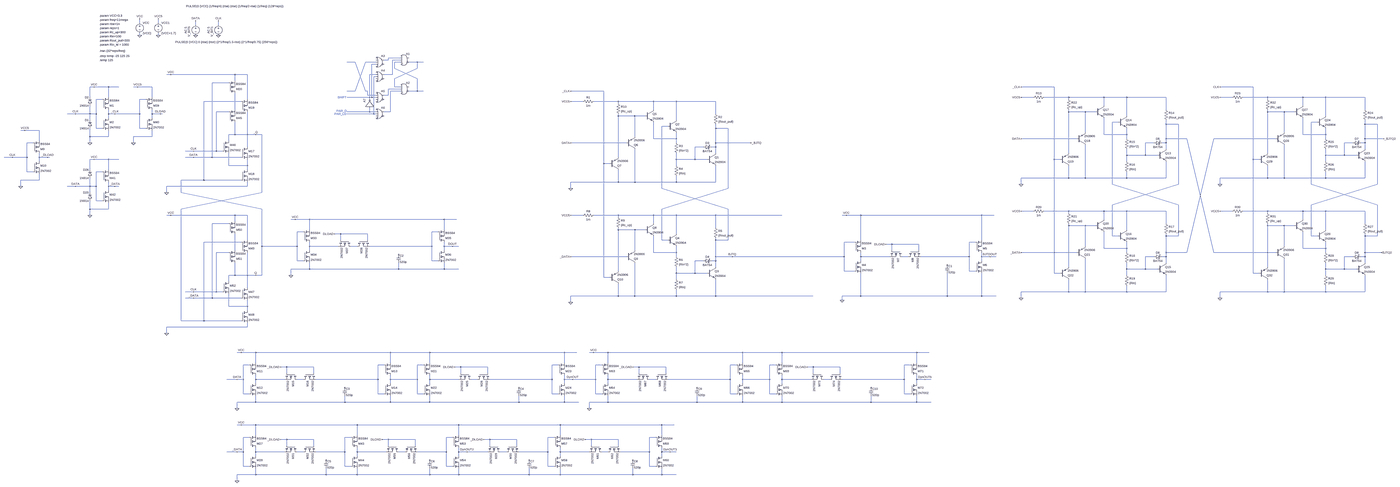
[diagram p0: schematic d_flop_cmos.asc, whole sheet]
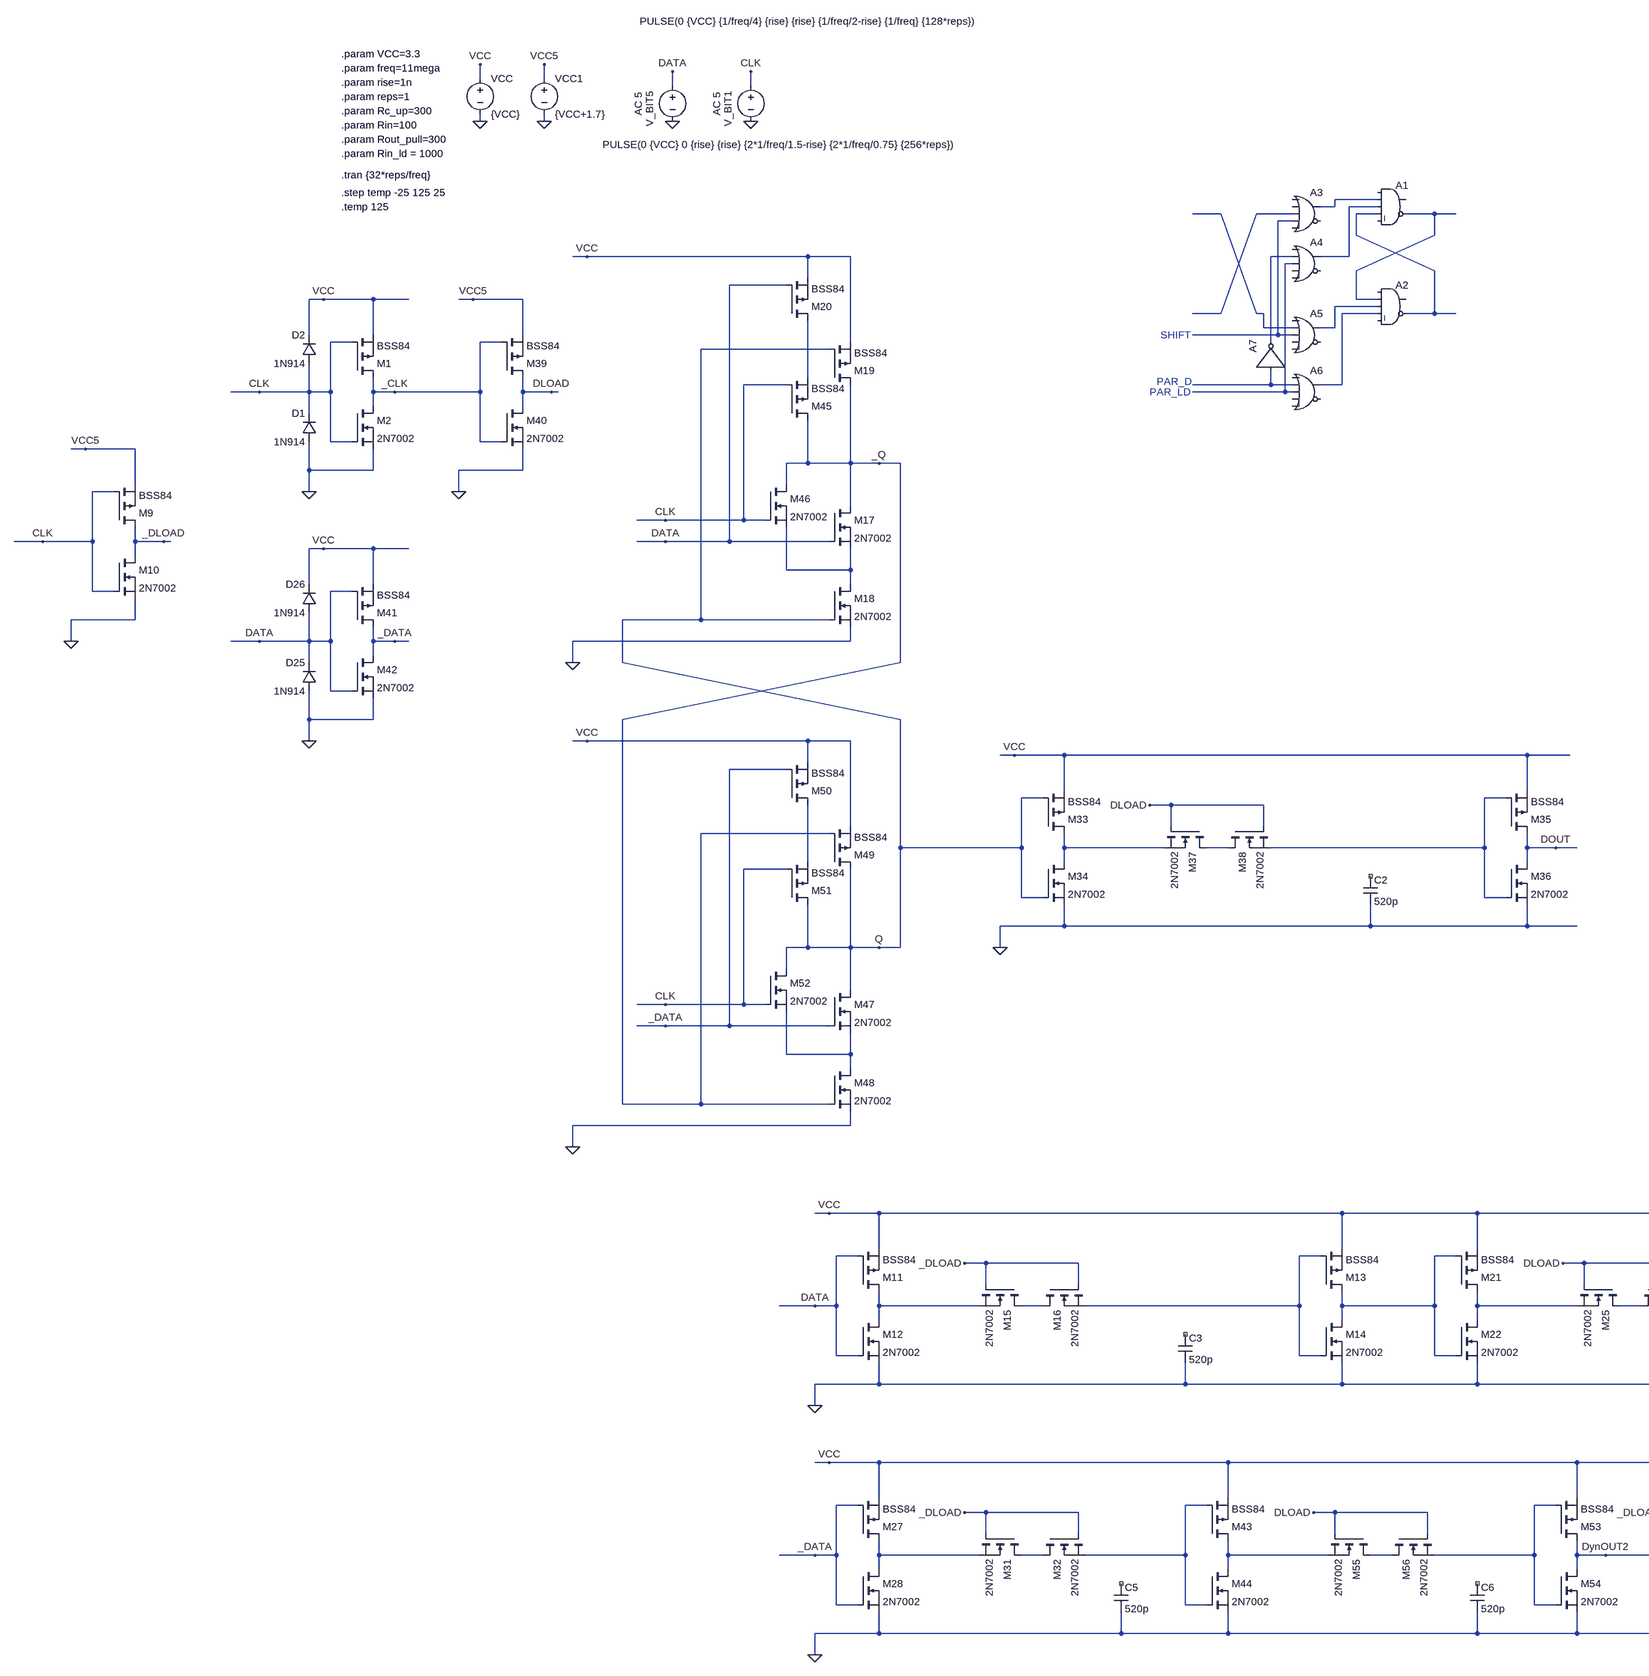
[diagram p1: schematic d_flop_cmos.asc, part, row 1 of 1, column 1 of 3]
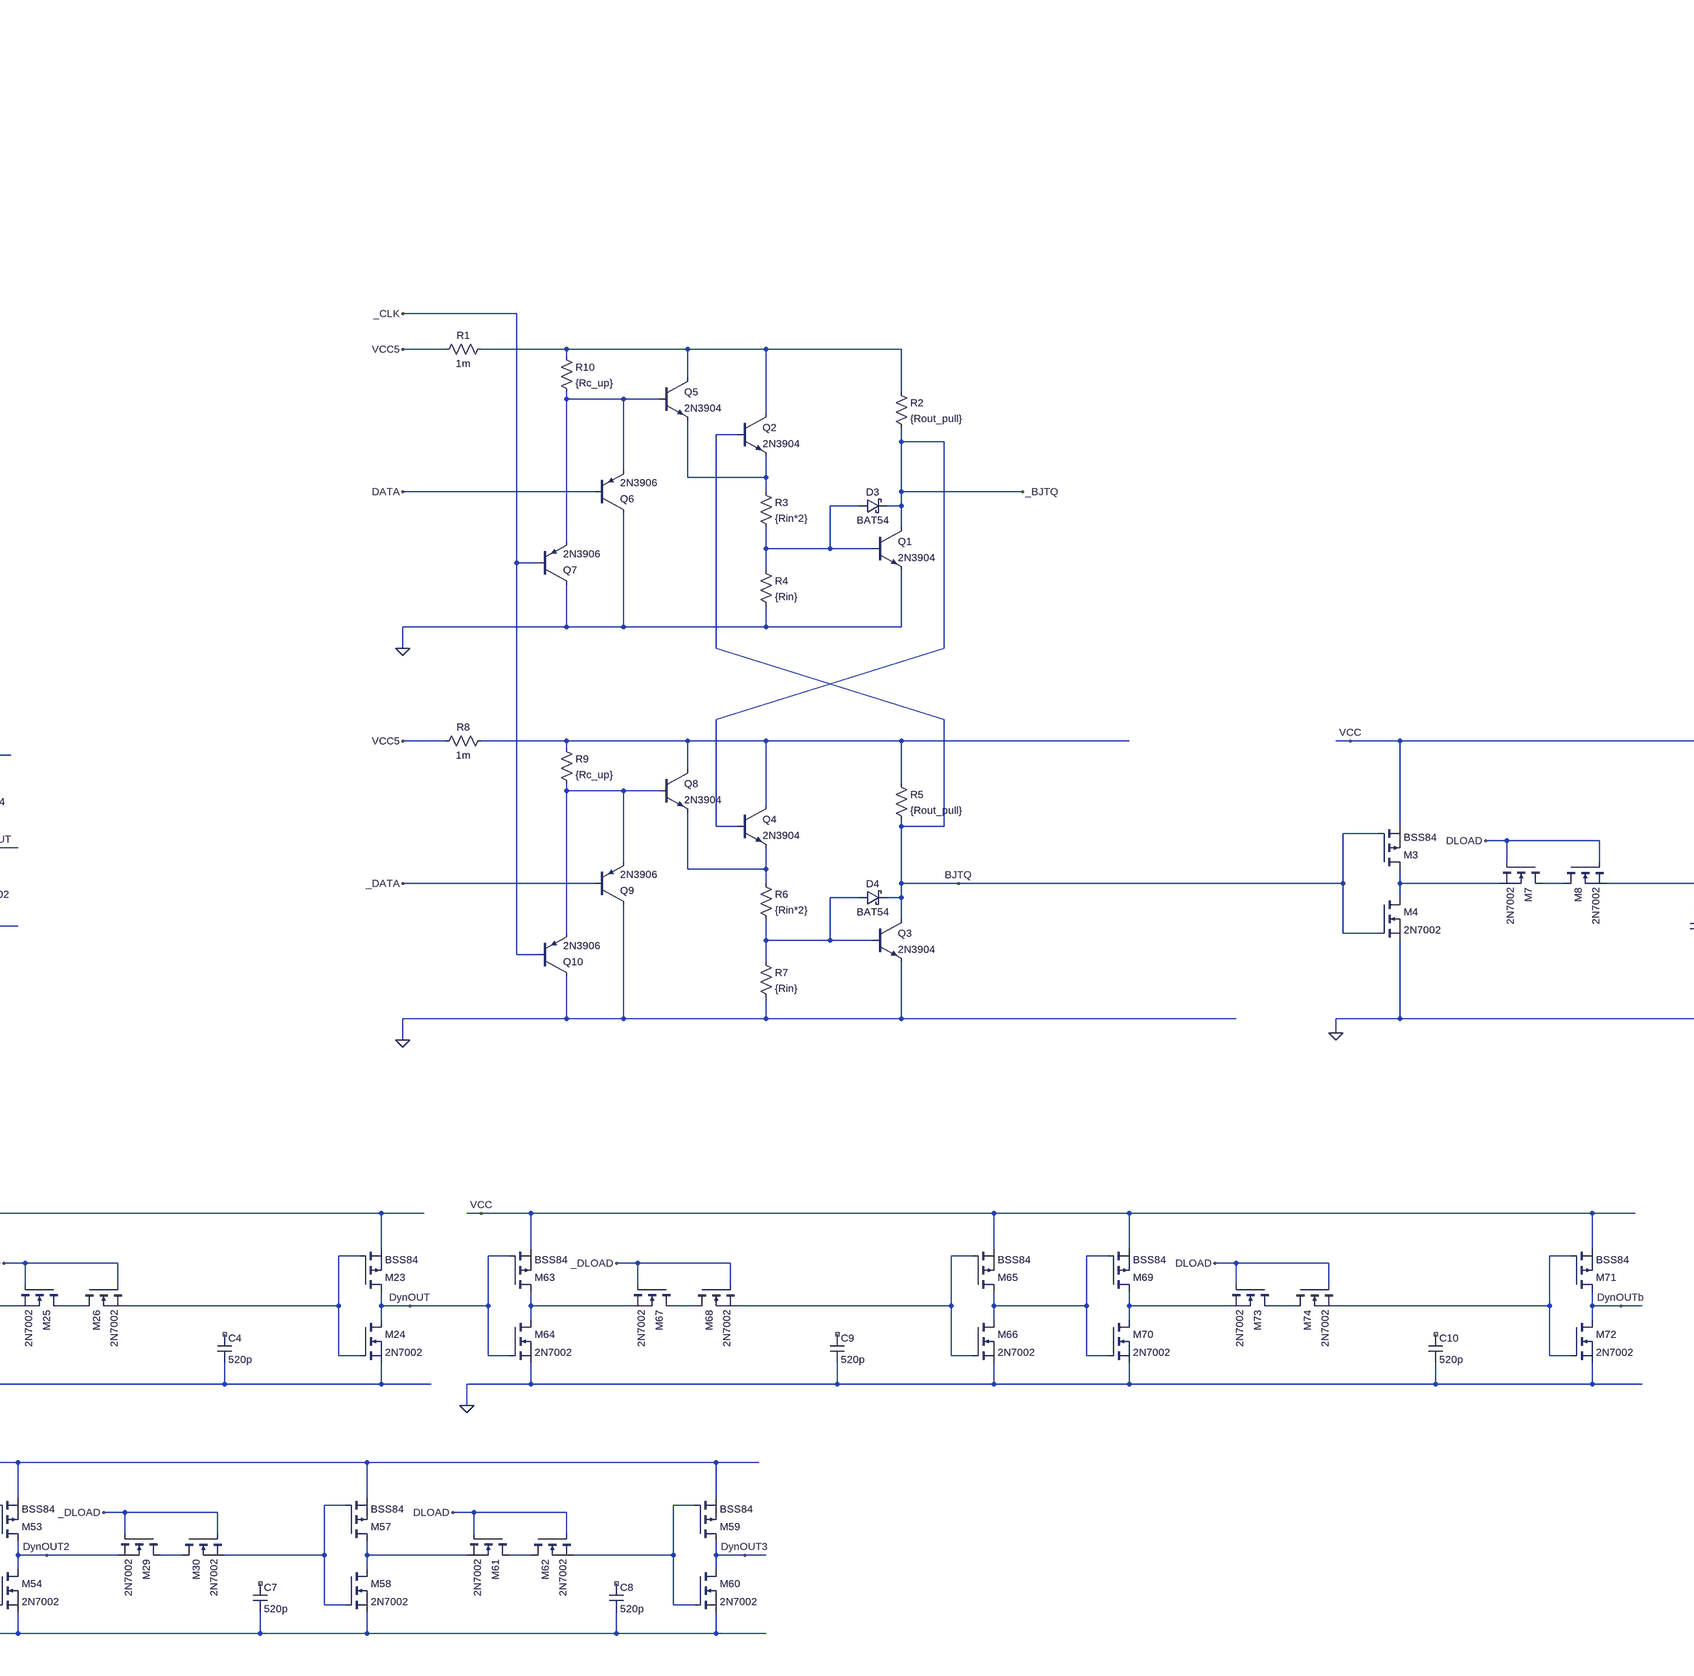
[diagram p2: schematic d_flop_cmos.asc, part, row 1 of 1, column 2 of 3]
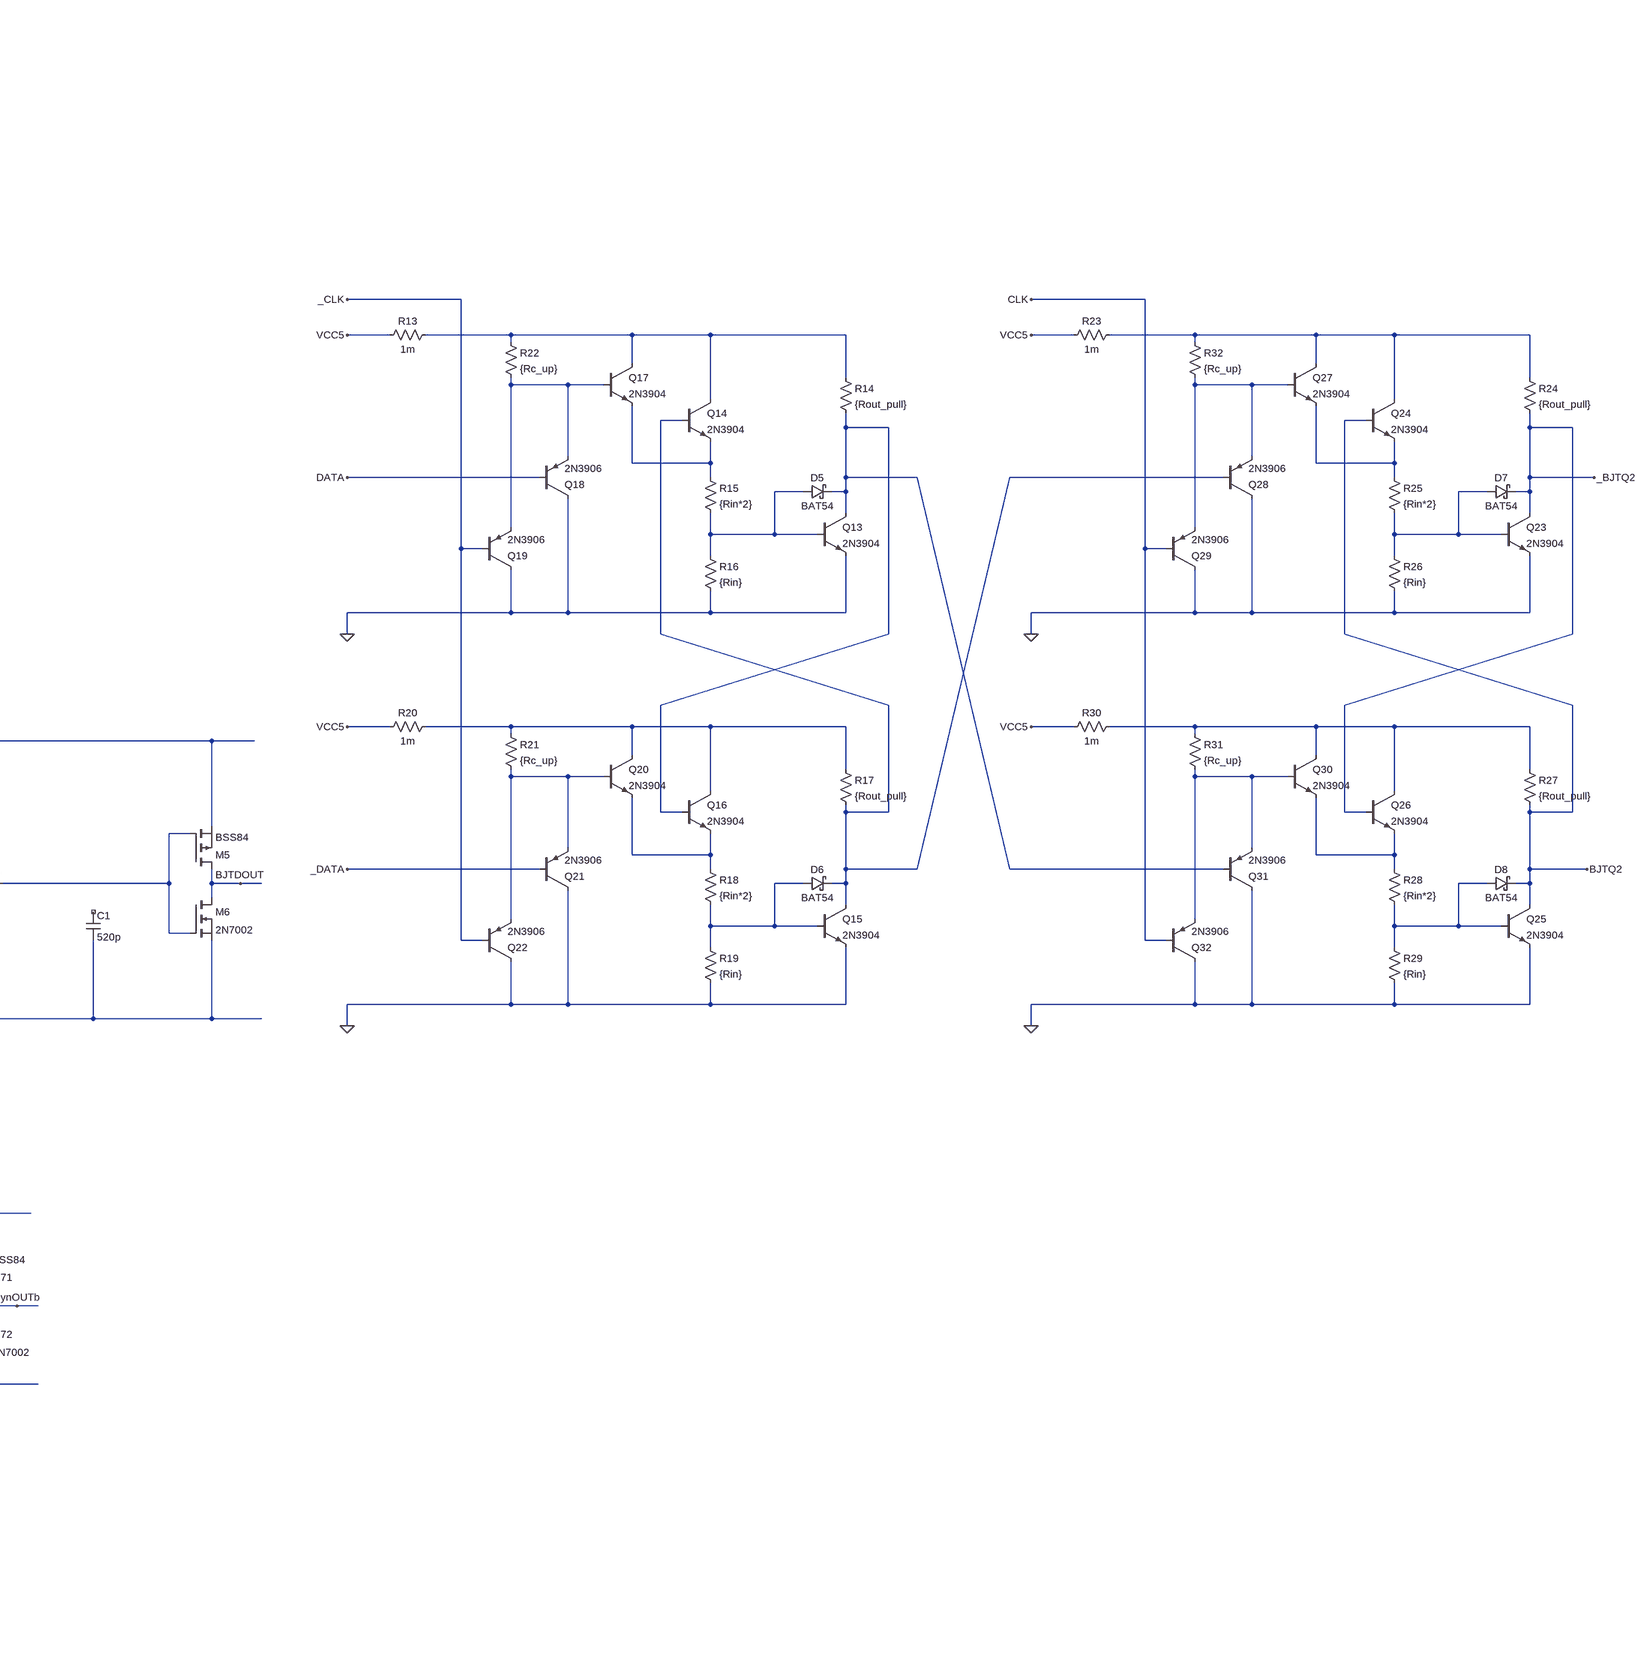
[diagram p3: schematic d_flop_cmos.asc, part, row 1 of 1, column 3 of 3]
d_flop_cmos.asc, the LTspice schematic file:
Version 4
SHEET 1 37460 9492
WIRE -2432 5424 -2432 5392
WIRE -2288 5424 -2288 5392
WIRE -2000 5440 -2000 5408
WIRE -1824 5440 -1824 5408
WIRE -2432 5520 -2432 5504
WIRE -2288 5520 -2288 5504
WIRE -416 5696 -512 5696
WIRE -512 5712 -512 5696
WIRE -512 5712 -544 5712
WIRE -416 5712 -480 5712
WIRE -768 5728 -832 5728
WIRE -608 5728 -688 5728
WIRE -416 5728 -464 5728
WIRE -288 5728 -352 5728
WIRE -240 5728 -288 5728
WIRE -608 5744 -640 5744
WIRE -464 5776 -464 5728
WIRE -288 5776 -288 5728
WIRE -2192 5824 -2224 5824
WIRE -1696 5824 -2192 5824
WIRE -1600 5824 -1696 5824
WIRE -608 5824 -656 5824
WIRE -480 5824 -480 5712
WIRE -480 5824 -544 5824
WIRE -608 5840 -624 5840
WIRE -464 5856 -288 5776
WIRE -288 5856 -464 5776
WIRE -1696 5872 -1696 5824
WIRE -1744 5888 -1872 5888
WIRE -2784 5920 -2816 5920
WIRE -2672 5920 -2784 5920
WIRE -2592 5920 -2672 5920
WIRE -2448 5920 -2480 5920
WIRE -2336 5920 -2448 5920
WIRE -464 5920 -464 5856
WIRE -416 5920 -464 5920
WIRE 5184 5920 4928 5920
WIRE 6720 5920 6464 5920
WIRE -416 5936 -512 5936
WIRE -768 5952 -688 5728
WIRE -768 5952 -832 5952
WIRE -688 5952 -768 5728
WIRE -672 5952 -688 5952
WIRE -416 5952 -496 5952
WIRE -288 5952 -288 5856
WIRE -288 5952 -352 5952
WIRE -240 5952 -288 5952
WIRE 1152 5952 896 5952
WIRE -672 5984 -672 5952
WIRE -608 5984 -672 5984
WIRE -512 5984 -512 5936
WIRE -512 5984 -544 5984
WIRE -2816 6000 -2816 5920
WIRE -2672 6000 -2672 5920
WIRE -2336 6000 -2336 5920
WIRE -640 6000 -640 5744
WIRE -640 6000 -832 6000
WIRE -608 6000 -640 6000
WIRE 5024 6000 4928 6000
WIRE 5296 6000 5104 6000
WIRE 5568 6000 5296 6000
WIRE 5744 6000 5568 6000
WIRE 6048 6000 5744 6000
WIRE 6560 6000 6464 6000
WIRE 6832 6000 6640 6000
WIRE 7104 6000 6832 6000
WIRE 7280 6000 7104 6000
WIRE 7584 6000 7280 6000
WIRE -2720 6016 -2768 6016
WIRE -2384 6016 -2432 6016
WIRE -1600 6016 -1600 5824
WIRE -656 6016 -656 5824
WIRE 5296 6016 5296 6000
WIRE 6832 6016 6832 6000
WIRE -1648 6032 -1936 6032
WIRE 992 6032 896 6032
WIRE 1264 6032 1072 6032
WIRE 1536 6032 1264 6032
WIRE 1712 6032 1536 6032
WIRE 2016 6032 1712 6032
WIRE 1264 6048 1264 6032
WIRE 5568 6064 5568 6000
WIRE 7104 6064 7104 6000
WIRE -1696 6096 -1696 5968
WIRE 1536 6096 1536 6032
WIRE 6048 6096 6048 6000
WIRE 7584 6096 7584 6000
WIRE -1744 6112 -1840 6112
WIRE -656 6112 -656 6080
WIRE -656 6112 -832 6112
WIRE -608 6112 -656 6112
WIRE -496 6112 -496 5952
WIRE -496 6112 -544 6112
WIRE 5296 6112 5296 6096
WIRE 5424 6112 5296 6112
WIRE 5504 6112 5424 6112
WIRE 6832 6112 6832 6096
WIRE 6960 6112 6832 6112
WIRE 7040 6112 6960 6112
WIRE -2928 6128 -2992 6128
WIRE -2816 6128 -2816 6064
WIRE -2816 6128 -2928 6128
WIRE -2768 6128 -2768 6016
WIRE -2768 6128 -2816 6128
WIRE -2672 6128 -2672 6096
WIRE -2624 6128 -2672 6128
WIRE -2432 6128 -2432 6016
WIRE -2432 6128 -2624 6128
WIRE -2336 6128 -2336 6096
WIRE -2272 6128 -2336 6128
WIRE -2256 6128 -2272 6128
WIRE -624 6128 -624 5840
WIRE -624 6128 -832 6128
WIRE -608 6128 -624 6128
WIRE 2016 6128 2016 6032
WIRE 1264 6144 1264 6128
WIRE 1392 6144 1264 6144
WIRE 1472 6144 1392 6144
WIRE 5744 6144 5744 6000
WIRE 7280 6144 7280 6000
WIRE -2672 6160 -2672 6128
WIRE -2336 6160 -2336 6128
WIRE -2816 6176 -2816 6128
WIRE 1712 6176 1712 6032
WIRE 5680 6192 5632 6192
WIRE 7216 6192 7168 6192
WIRE 6048 6208 6048 6176
WIRE 6144 6208 6048 6208
WIRE 7584 6208 7584 6176
WIRE 7680 6208 7584 6208
WIRE 1648 6224 1600 6224
WIRE -2768 6240 -2768 6128
WIRE -2720 6240 -2768 6240
WIRE -2432 6240 -2432 6128
WIRE -2384 6240 -2432 6240
WIRE 2016 6240 2016 6208
WIRE 2112 6240 2016 6240
WIRE -3344 6256 -3376 6256
WIRE -3232 6256 -3344 6256
WIRE 5424 6272 5424 6112
WIRE 6960 6272 6960 6112
WIRE -1696 6288 -1696 6192
WIRE -1696 6288 -1744 6288
WIRE -1600 6288 -1600 6112
WIRE -1600 6288 -1696 6288
WIRE -1536 6288 -1600 6288
WIRE -1488 6288 -1536 6288
WIRE 5568 6288 5568 6160
WIRE 5744 6288 5744 6240
WIRE 5744 6288 5568 6288
WIRE 7104 6288 7104 6160
WIRE 7280 6288 7280 6240
WIRE 7280 6288 7104 6288
WIRE -2816 6304 -2816 6240
WIRE -2672 6304 -2672 6256
WIRE -2672 6304 -2816 6304
WIRE -2336 6304 -2336 6256
WIRE -2336 6304 -2480 6304
WIRE 1392 6304 1392 6144
WIRE 1536 6320 1536 6192
WIRE 1712 6320 1712 6272
WIRE 1712 6320 1536 6320
WIRE 5360 6320 4928 6320
WIRE 5744 6320 5744 6288
WIRE 6048 6320 6048 6208
WIRE 6208 6320 6048 6320
WIRE 6896 6320 6416 6320
WIRE 7280 6320 7280 6288
WIRE 7584 6320 7584 6208
WIRE 7728 6320 7584 6320
WIRE -3232 6336 -3232 6256
WIRE -1744 6336 -1744 6288
WIRE -3280 6352 -3328 6352
WIRE -2816 6352 -2816 6304
WIRE -2480 6352 -2480 6304
WIRE 1328 6352 896 6352
WIRE 1712 6352 1712 6320
WIRE 2016 6352 2016 6240
WIRE 2288 6352 2016 6352
WIRE 5952 6352 5888 6352
WIRE 6048 6352 6048 6320
WIRE 6048 6352 6016 6352
WIRE 7488 6352 7424 6352
WIRE 7584 6352 7584 6320
WIRE 7584 6352 7552 6352
WIRE -1600 6384 -1600 6288
WIRE 1920 6384 1856 6384
WIRE 2016 6384 2016 6352
WIRE 2016 6384 1984 6384
WIRE 6048 6400 6048 6352
WIRE 7584 6400 7584 6352
WIRE -2016 6416 -2080 6416
WIRE -1840 6416 -1840 6112
WIRE -1840 6416 -2016 6416
WIRE -1792 6416 -1840 6416
WIRE 2016 6432 2016 6384
WIRE 5296 6432 5296 6112
WIRE 6832 6432 6832 6112
WIRE 5744 6448 5744 6400
WIRE 5888 6448 5888 6352
WIRE 5888 6448 5744 6448
WIRE 5984 6448 5888 6448
WIRE 7280 6448 7280 6400
WIRE 7424 6448 7424 6352
WIRE 7424 6448 7280 6448
WIRE 7520 6448 7424 6448
WIRE -3440 6464 -3504 6464
WIRE -3328 6464 -3328 6352
WIRE -3328 6464 -3440 6464
WIRE -3232 6464 -3232 6432
WIRE -3168 6464 -3232 6464
WIRE -3152 6464 -3168 6464
WIRE -2016 6464 -2080 6464
WIRE -1872 6464 -1872 5888
WIRE -1872 6464 -2016 6464
WIRE -1648 6464 -1872 6464
WIRE 1264 6464 1264 6144
WIRE -2784 6480 -2816 6480
WIRE -2672 6480 -2784 6480
WIRE -2592 6480 -2672 6480
WIRE 1712 6480 1712 6432
WIRE 1856 6480 1856 6384
WIRE 1856 6480 1712 6480
WIRE 1952 6480 1856 6480
WIRE 5184 6480 5184 5920
WIRE 5232 6480 5184 6480
WIRE 6720 6480 6720 5920
WIRE 6768 6480 6720 6480
WIRE -3232 6496 -3232 6464
WIRE 5744 6496 5744 6448
WIRE 7280 6496 7280 6448
WIRE 1152 6512 1152 5952
WIRE 1200 6512 1152 6512
WIRE -1744 6528 -1744 6432
WIRE -1600 6528 -1600 6480
WIRE -1600 6528 -1744 6528
WIRE 1712 6528 1712 6480
WIRE -2816 6560 -2816 6480
WIRE -2672 6560 -2672 6480
WIRE -1600 6560 -1600 6528
WIRE -3328 6576 -3328 6464
WIRE -3280 6576 -3328 6576
WIRE -2720 6576 -2768 6576
WIRE 5296 6624 5296 6528
WIRE 5296 6624 4928 6624
WIRE 5424 6624 5424 6368
WIRE 5424 6624 5296 6624
WIRE 5744 6624 5744 6576
WIRE 5744 6624 5424 6624
WIRE 6048 6624 6048 6496
WIRE 6048 6624 5744 6624
WIRE 6832 6624 6832 6528
WIRE 6832 6624 6464 6624
WIRE 6960 6624 6960 6368
WIRE 6960 6624 6832 6624
WIRE 7280 6624 7280 6576
WIRE 7280 6624 6960 6624
WIRE 7584 6624 7584 6496
WIRE 7584 6624 7280 6624
WIRE -3232 6640 -3232 6592
WIRE -3232 6640 -3376 6640
WIRE -1936 6640 -1936 6032
WIRE -1936 6640 -2112 6640
WIRE -1648 6640 -1936 6640
WIRE 1264 6656 1264 6560
WIRE 1264 6656 896 6656
WIRE 1392 6656 1392 6400
WIRE 1392 6656 1264 6656
WIRE 1712 6656 1712 6608
WIRE 1712 6656 1392 6656
WIRE 2016 6656 2016 6528
WIRE 2016 6656 1712 6656
WIRE 4928 6672 4928 6624
WIRE 5632 6672 5632 6192
WIRE 6144 6672 6144 6208
WIRE 6464 6672 6464 6624
WIRE 7168 6672 7168 6192
WIRE 7680 6672 7680 6208
WIRE -3376 6688 -3376 6640
WIRE -2928 6688 -2992 6688
WIRE -2816 6688 -2816 6624
WIRE -2816 6688 -2928 6688
WIRE -2768 6688 -2768 6576
WIRE -2768 6688 -2816 6688
WIRE -2672 6688 -2672 6656
WIRE -2624 6688 -2672 6688
WIRE -2592 6688 -2624 6688
WIRE -1600 6688 -1600 6656
WIRE -1600 6688 -2224 6688
WIRE 896 6704 896 6656
WIRE 1600 6704 1600 6224
WIRE 2112 6704 2112 6240
WIRE -2672 6720 -2672 6688
WIRE -2816 6736 -2816 6688
WIRE -2224 6736 -2224 6688
WIRE -2112 6736 -2112 6640
WIRE -1488 6736 -1488 6288
WIRE -2768 6800 -2768 6688
WIRE -2720 6800 -2768 6800
WIRE 5632 6832 6144 6672
WIRE 6144 6832 5632 6672
WIRE 7168 6832 7680 6672
WIRE 7680 6832 7168 6672
WIRE -2816 6864 -2816 6800
WIRE -2672 6864 -2672 6816
WIRE -2672 6864 -2816 6864
WIRE -2112 6864 -1488 6736
WIRE -1488 6864 -2112 6736
WIRE 1600 6864 2112 6704
WIRE 2112 6864 1600 6704
WIRE 5024 6880 4928 6880
WIRE 5296 6880 5104 6880
WIRE 5568 6880 5296 6880
WIRE 5744 6880 5568 6880
WIRE 6048 6880 5744 6880
WIRE 6560 6880 6464 6880
WIRE 6832 6880 6640 6880
WIRE 7104 6880 6832 6880
WIRE 7280 6880 7104 6880
WIRE 7584 6880 7280 6880
WIRE 5296 6896 5296 6880
WIRE 6832 6896 6832 6880
WIRE -2816 6912 -2816 6864
WIRE -2192 6912 -2224 6912
WIRE -1696 6912 -2192 6912
WIRE -1600 6912 -1696 6912
WIRE 992 6912 896 6912
WIRE 1264 6912 1072 6912
WIRE 1536 6912 1264 6912
WIRE 1712 6912 1536 6912
WIRE 2016 6912 1712 6912
WIRE 2528 6912 2016 6912
WIRE 3024 6912 2992 6912
WIRE 3136 6912 3024 6912
WIRE 4176 6912 3136 6912
WIRE 4272 6912 4176 6912
WIRE 1264 6928 1264 6912
WIRE -1232 6944 -1264 6944
WIRE -1120 6944 -1232 6944
WIRE -80 6944 -1120 6944
WIRE 16 6944 -80 6944
WIRE 5568 6944 5568 6880
WIRE 7104 6944 7104 6880
WIRE -1696 6960 -1696 6912
WIRE -1744 6976 -1872 6976
WIRE 1536 6976 1536 6912
WIRE 6048 6976 6048 6880
WIRE 7584 6976 7584 6880
WIRE 5296 6992 5296 6976
WIRE 5424 6992 5296 6992
WIRE 5504 6992 5424 6992
WIRE 6832 6992 6832 6976
WIRE 6960 6992 6832 6992
WIRE 7040 6992 6960 6992
WIRE 2016 7008 2016 6912
WIRE -1120 7024 -1120 6944
WIRE -80 7024 -80 6944
WIRE 1264 7024 1264 7008
WIRE 1392 7024 1264 7024
WIRE 1472 7024 1392 7024
WIRE 5744 7024 5744 6880
WIRE 7280 7024 7280 6880
WIRE -1168 7040 -1216 7040
WIRE -128 7040 -176 7040
WIRE -880 7056 -928 7056
WIRE -672 7056 -880 7056
WIRE 1712 7056 1712 6912
WIRE 5632 7072 5632 6832
WIRE 5680 7072 5632 7072
WIRE 6048 7072 6048 7056
WIRE 6144 7072 6144 6832
WIRE 6144 7072 6048 7072
WIRE 7168 7072 7168 6832
WIRE 7216 7072 7168 7072
WIRE 7584 7072 7584 7056
WIRE 7680 7072 7680 6832
WIRE 7680 7072 7584 7072
WIRE -1600 7104 -1600 6912
WIRE -880 7104 -880 7056
WIRE -672 7104 -672 7056
WIRE 1600 7104 1600 6864
WIRE 1648 7104 1600 7104
WIRE 2016 7104 2016 7088
WIRE 2112 7104 2112 6864
WIRE 2112 7104 2016 7104
WIRE 3136 7104 3136 6912
WIRE 4176 7104 4176 6912
WIRE -1648 7120 -1936 7120
WIRE 3088 7120 3008 7120
WIRE 4128 7120 4080 7120
WIRE 3376 7136 3328 7136
WIRE 3584 7136 3376 7136
WIRE -1488 7152 -1488 6864
WIRE -1216 7152 -1216 7040
WIRE -1216 7152 -1488 7152
WIRE -1120 7152 -1120 7120
WIRE -896 7152 -1120 7152
WIRE -752 7152 -800 7152
WIRE -176 7152 -176 7040
WIRE -176 7152 -656 7152
WIRE -80 7152 -80 7120
WIRE -16 7152 -80 7152
WIRE 32 7152 -16 7152
WIRE 5424 7152 5424 6992
WIRE 6960 7152 6960 6992
WIRE 5568 7168 5568 7040
WIRE 5744 7168 5744 7120
WIRE 5744 7168 5568 7168
WIRE 7104 7168 7104 7040
WIRE 7280 7168 7280 7120
WIRE 7280 7168 7104 7168
WIRE -1696 7184 -1696 7056
WIRE -1120 7184 -1120 7152
WIRE -80 7184 -80 7152
WIRE 1392 7184 1392 7024
WIRE 3376 7184 3376 7136
WIRE 3584 7184 3584 7136
WIRE -1744 7200 -1840 7200
WIRE 1536 7200 1536 7072
WIRE 1712 7200 1712 7152
WIRE 1712 7200 1536 7200
WIRE 5360 7200 4928 7200
WIRE 5744 7200 5744 7168
WIRE 6048 7200 6048 7072
WIRE 6208 7200 6416 6320
WIRE 6208 7200 6048 7200
WIRE 6416 7200 6208 6320
WIRE 6896 7200 6416 7200
WIRE 7280 7200 7280 7168
WIRE 7584 7200 7584 7072
WIRE 7712 7200 7584 7200
WIRE 1328 7232 896 7232
WIRE 1712 7232 1712 7200
WIRE 2016 7232 2016 7104
WIRE 2144 7232 2016 7232
WIRE 3008 7232 3008 7120
WIRE 3008 7232 2144 7232
WIRE 3136 7232 3136 7200
WIRE 3360 7232 3136 7232
WIRE 3504 7232 3456 7232
WIRE 4080 7232 4080 7120
WIRE 4080 7232 3600 7232
WIRE 4176 7232 4176 7200
WIRE 4240 7232 4176 7232
WIRE 4288 7232 4240 7232
WIRE 5952 7232 5888 7232
WIRE 6048 7232 6048 7200
WIRE 6048 7232 6016 7232
WIRE 7488 7232 7424 7232
WIRE 7584 7232 7584 7200
WIRE 7584 7232 7552 7232
WIRE -1216 7264 -1216 7152
WIRE -1168 7264 -1216 7264
WIRE -176 7264 -176 7152
WIRE -128 7264 -176 7264
WIRE 1920 7264 1856 7264
WIRE 2016 7264 2016 7232
WIRE 2016 7264 1984 7264
WIRE 3136 7264 3136 7232
WIRE 4176 7264 4176 7232
WIRE 6048 7280 6048 7232
WIRE 7584 7280 7584 7232
WIRE 2016 7312 2016 7264
WIRE 5296 7312 5296 6992
WIRE 6832 7312 6832 6992
WIRE -1120 7328 -1120 7280
WIRE -1120 7328 -1264 7328
WIRE -432 7328 -432 7280
WIRE -432 7328 -1120 7328
WIRE -80 7328 -80 7280
WIRE -80 7328 -432 7328
WIRE 32 7328 -80 7328
WIRE 5744 7328 5744 7280
WIRE 5888 7328 5888 7232
WIRE 5888 7328 5744 7328
WIRE 5984 7328 5888 7328
WIRE 7280 7328 7280 7280
WIRE 7424 7328 7424 7232
WIRE 7424 7328 7280 7328
WIRE 7520 7328 7424 7328
WIRE 1264 7344 1264 7024
WIRE 3008 7344 3008 7232
WIRE 3088 7344 3008 7344
WIRE 4080 7344 4080 7232
WIRE 4128 7344 4080 7344
WIRE 1712 7360 1712 7312
WIRE 1856 7360 1856 7264
WIRE 1856 7360 1712 7360
WIRE 1952 7360 1856 7360
WIRE 5184 7360 5184 6480
WIRE 5232 7360 5184 7360
WIRE 6720 7360 6720 6480
WIRE 6768 7360 6720 7360
WIRE -1696 7376 -1696 7280
WIRE -1696 7376 -1744 7376
WIRE -1600 7376 -1600 7200
WIRE -1600 7376 -1696 7376
WIRE -1536 7376 -1600 7376
WIRE -1488 7376 -1488 7152
WIRE -1488 7376 -1536 7376
WIRE -1264 7376 -1264 7328
WIRE 5744 7376 5744 7328
WIRE 7280 7376 7280 7328
WIRE 1152 7392 1152 6512
WIRE 1200 7392 1152 7392
WIRE 1712 7408 1712 7360
WIRE -1744 7424 -1744 7376
WIRE -1600 7472 -1600 7376
WIRE -2016 7504 -2080 7504
WIRE -1840 7504 -1840 7200
WIRE -1840 7504 -2016 7504
WIRE -1792 7504 -1840 7504
WIRE 5296 7504 5296 7408
WIRE 5296 7504 4928 7504
WIRE 5424 7504 5424 7248
WIRE 5424 7504 5296 7504
WIRE 5744 7504 5744 7456
WIRE 5744 7504 5424 7504
WIRE 6048 7504 6048 7376
WIRE 6048 7504 5744 7504
WIRE 6832 7504 6832 7408
WIRE 6832 7504 6464 7504
WIRE 6960 7504 6960 7248
WIRE 6960 7504 6832 7504
WIRE 7280 7504 7280 7456
WIRE 7280 7504 6960 7504
WIRE 7584 7504 7584 7376
WIRE 7584 7504 7280 7504
WIRE 1264 7536 1264 7440
WIRE 1264 7536 896 7536
WIRE 1392 7536 1392 7280
WIRE 1392 7536 1264 7536
WIRE 1712 7536 1712 7488
WIRE 1712 7536 1392 7536
WIRE 2016 7536 2016 7408
WIRE 2016 7536 1712 7536
WIRE 2768 7536 2016 7536
WIRE 3136 7536 3136 7360
WIRE 3136 7536 2992 7536
WIRE 3824 7536 3824 7360
WIRE 3824 7536 3136 7536
WIRE 4176 7536 4176 7360
WIRE 4176 7536 3824 7536
WIRE 4288 7536 4176 7536
WIRE -2016 7552 -2080 7552
WIRE -1872 7552 -1872 6976
WIRE -1872 7552 -2016 7552
WIRE -1648 7552 -1872 7552
WIRE 4928 7552 4928 7504
WIRE 6464 7552 6464 7504
WIRE 2992 7568 2992 7536
WIRE 896 7584 896 7536
WIRE -1744 7616 -1744 7520
WIRE -1600 7616 -1600 7568
WIRE -1600 7616 -1744 7616
WIRE -1600 7648 -1600 7616
WIRE -2112 7728 -2112 6864
WIRE -1936 7728 -1936 7120
WIRE -1936 7728 -2112 7728
WIRE -1648 7728 -1936 7728
WIRE -1600 7776 -1600 7744
WIRE -1600 7776 -2224 7776
WIRE -2224 7824 -2224 7776
WIRE -1648 8192 -1680 8192
WIRE -1536 8192 -1648 8192
WIRE -496 8192 -1536 8192
WIRE -192 8192 -496 8192
WIRE 848 8192 -192 8192
WIRE 944 8192 848 8192
WIRE 1072 8192 1040 8192
WIRE 1184 8192 1072 8192
WIRE 2224 8192 1184 8192
WIRE 2528 8192 2224 8192
WIRE 3568 8192 2528 8192
WIRE 3664 8192 3568 8192
WIRE -1536 8272 -1536 8192
WIRE -496 8272 -496 8192
WIRE -192 8272 -192 8192
WIRE 848 8272 848 8192
WIRE 1184 8272 1184 8192
WIRE 2224 8272 2224 8192
WIRE 2528 8272 2528 8192
WIRE 3568 8272 3568 8192
WIRE -1584 8288 -1632 8288
WIRE -544 8288 -592 8288
WIRE -240 8288 -288 8288
WIRE 800 8288 752 8288
WIRE 1136 8288 1088 8288
WIRE 2176 8288 2128 8288
WIRE 2480 8288 2432 8288
WIRE 3520 8288 3472 8288
WIRE -1296 8304 -1344 8304
WIRE -1088 8304 -1296 8304
WIRE 48 8304 0 8304
WIRE 256 8304 48 8304
WIRE 1424 8304 1376 8304
WIRE 1632 8304 1424 8304
WIRE 2768 8304 2720 8304
WIRE 2976 8304 2768 8304
WIRE -1296 8352 -1296 8304
WIRE -1088 8352 -1088 8304
WIRE 48 8352 48 8304
WIRE 256 8352 256 8304
WIRE 1424 8352 1424 8304
WIRE 1632 8352 1632 8304
WIRE 2768 8352 2768 8304
WIRE 2976 8352 2976 8304
WIRE -1680 8400 -1760 8400
WIRE -1632 8400 -1632 8288
WIRE -1632 8400 -1680 8400
WIRE -1536 8400 -1536 8368
WIRE -1312 8400 -1536 8400
WIRE -1168 8400 -1216 8400
WIRE -592 8400 -592 8288
WIRE -592 8400 -1072 8400
WIRE -496 8400 -496 8368
WIRE -288 8400 -288 8288
WIRE -288 8400 -496 8400
WIRE -192 8400 -192 8368
WIRE 32 8400 -192 8400
WIRE 176 8400 128 8400
WIRE 752 8400 752 8288
WIRE 752 8400 272 8400
WIRE 848 8400 848 8368
WIRE 912 8400 848 8400
WIRE 1088 8400 1088 8288
WIRE 1088 8400 912 8400
WIRE 1184 8400 1184 8368
WIRE 1408 8400 1184 8400
WIRE 1552 8400 1504 8400
WIRE 2128 8400 2128 8288
WIRE 2128 8400 1648 8400
WIRE 2224 8400 2224 8368
WIRE 2432 8400 2432 8288
WIRE 2432 8400 2224 8400
WIRE 2528 8400 2528 8368
WIRE 2752 8400 2528 8400
WIRE 2896 8400 2848 8400
WIRE 3472 8400 3472 8288
WIRE 3472 8400 2992 8400
WIRE 3568 8400 3568 8368
WIRE 3632 8400 3568 8400
WIRE 3680 8400 3632 8400
WIRE -1536 8432 -1536 8400
WIRE -496 8432 -496 8400
WIRE -192 8432 -192 8400
WIRE 848 8432 848 8400
WIRE 1184 8432 1184 8400
WIRE 2224 8432 2224 8400
WIRE 2528 8432 2528 8400
WIRE 3568 8432 3568 8400
WIRE -1632 8512 -1632 8400
WIRE -1584 8512 -1632 8512
WIRE -592 8512 -592 8400
WIRE -544 8512 -592 8512
WIRE -288 8512 -288 8400
WIRE -240 8512 -288 8512
WIRE 752 8512 752 8400
WIRE 800 8512 752 8512
WIRE 1088 8512 1088 8400
WIRE 1136 8512 1088 8512
WIRE 2128 8512 2128 8400
WIRE 2176 8512 2128 8512
WIRE 2432 8512 2432 8400
WIRE 2480 8512 2432 8512
WIRE 3472 8512 3472 8400
WIRE 3520 8512 3472 8512
WIRE -1536 8576 -1536 8528
WIRE -1536 8576 -1680 8576
WIRE -848 8576 -848 8528
WIRE -848 8576 -1536 8576
WIRE -496 8576 -496 8528
WIRE -496 8576 -848 8576
WIRE -192 8576 -192 8528
WIRE -192 8576 -496 8576
WIRE 496 8576 496 8528
WIRE 496 8576 -192 8576
WIRE 848 8576 848 8528
WIRE 848 8576 496 8576
WIRE 960 8576 848 8576
WIRE 1184 8576 1184 8528
WIRE 1184 8576 1040 8576
WIRE 1872 8576 1872 8528
WIRE 1872 8576 1184 8576
WIRE 2224 8576 2224 8528
WIRE 2224 8576 1872 8576
WIRE 2528 8576 2528 8528
WIRE 2528 8576 2224 8576
WIRE 3216 8576 3216 8528
WIRE 3216 8576 2528 8576
WIRE 3568 8576 3568 8528
WIRE 3568 8576 3216 8576
WIRE 3680 8576 3568 8576
WIRE -1680 8624 -1680 8576
WIRE 1040 8624 1040 8576
WIRE -1648 8752 -1680 8752
WIRE -1536 8752 -1648 8752
WIRE -752 8752 -1536 8752
WIRE 32 8752 -752 8752
WIRE 816 8752 32 8752
WIRE 1600 8752 816 8752
WIRE 1696 8752 1600 8752
WIRE -1536 8832 -1536 8752
WIRE -752 8832 -752 8752
WIRE 32 8832 32 8752
WIRE 816 8832 816 8752
WIRE 1600 8832 1600 8752
WIRE -1584 8848 -1632 8848
WIRE -800 8848 -848 8848
WIRE -16 8848 -64 8848
WIRE 768 8848 720 8848
WIRE 1552 8848 1504 8848
WIRE -1296 8864 -1344 8864
WIRE -1088 8864 -1296 8864
WIRE -512 8864 -560 8864
WIRE -304 8864 -512 8864
WIRE 272 8864 224 8864
WIRE 480 8864 272 8864
WIRE 1056 8864 1008 8864
WIRE 1264 8864 1056 8864
WIRE -1296 8912 -1296 8864
WIRE -1088 8912 -1088 8864
WIRE -512 8912 -512 8864
WIRE -304 8912 -304 8864
WIRE 272 8912 272 8864
WIRE 480 8912 480 8864
WIRE 1056 8912 1056 8864
WIRE 1264 8912 1264 8864
WIRE -1680 8960 -1760 8960
WIRE -1632 8960 -1632 8848
WIRE -1632 8960 -1680 8960
WIRE -1536 8960 -1536 8928
WIRE -1312 8960 -1536 8960
WIRE -1168 8960 -1216 8960
WIRE -848 8960 -848 8848
WIRE -848 8960 -1072 8960
WIRE -752 8960 -752 8928
WIRE -528 8960 -752 8960
WIRE -384 8960 -432 8960
WIRE -64 8960 -64 8848
WIRE -64 8960 -288 8960
WIRE 32 8960 32 8928
WIRE 96 8960 32 8960
WIRE 256 8960 96 8960
WIRE 400 8960 352 8960
WIRE 720 8960 720 8848
WIRE 720 8960 496 8960
WIRE 816 8960 816 8928
WIRE 1040 8960 816 8960
WIRE 1184 8960 1136 8960
WIRE 1504 8960 1504 8848
WIRE 1504 8960 1280 8960
WIRE 1600 8960 1600 8928
WIRE 1664 8960 1600 8960
WIRE 1712 8960 1664 8960
WIRE -1536 8992 -1536 8960
WIRE -752 8992 -752 8960
WIRE 32 8992 32 8960
WIRE 816 8992 816 8960
WIRE 1600 8992 1600 8960
WIRE -1632 9072 -1632 8960
WIRE -1584 9072 -1632 9072
WIRE -848 9072 -848 8960
WIRE -800 9072 -848 9072
WIRE -64 9072 -64 8960
WIRE -16 9072 -64 9072
WIRE 720 9072 720 8960
WIRE 768 9072 720 9072
WIRE 1504 9072 1504 8960
WIRE 1552 9072 1504 9072
WIRE -1536 9136 -1536 9088
WIRE -1536 9136 -1680 9136
WIRE -992 9136 -992 9088
WIRE -992 9136 -1536 9136
WIRE -752 9136 -752 9088
WIRE -752 9136 -992 9136
WIRE -192 9136 -192 9088
WIRE -192 9136 -752 9136
WIRE 32 9136 32 9088
WIRE 32 9136 -192 9136
WIRE 576 9136 576 9088
WIRE 576 9136 32 9136
WIRE 816 9136 816 9088
WIRE 816 9136 576 9136
WIRE 1376 9136 1376 9088
WIRE 1376 9136 816 9136
WIRE 1600 9136 1600 9088
WIRE 1600 9136 1376 9136
WIRE 1712 9136 1600 9136
WIRE -1680 9184 -1680 9136
FLAG -2432 5520 0
FLAG -2432 5392 VCC
FLAG -2000 5520 0
FLAG -2000 5408 DATA
FLAG -1824 5520 0
FLAG -1824 5408 CLK
FLAG -1536 6288 _Q
FLAG -2016 6464 DATA
FLAG -2224 6736 0
FLAG -2192 5824 VCC
FLAG -2288 5520 0
FLAG -2288 5392 VCC5
FLAG -16 7152 DOUT
FLAG -1264 7376 0
FLAG -1232 6944 VCC
FLAG -2448 5920 VCC5
FLAG -2480 6352 0
FLAG -2784 6480 VCC
FLAG -2816 6912 0
FLAG -2928 6688 DATA
FLAG -2016 6416 CLK
FLAG -1536 7376 Q
FLAG -2016 7552 _DATA
FLAG -2224 7824 0
FLAG -2192 6912 VCC
FLAG -2016 7504 CLK
FLAG -2624 6688 _DATA
FLAG -2784 5920 VCC
FLAG -2816 6352 0
FLAG -2928 6128 CLK
FLAG -2624 6128 _CLK
FLAG -2272 6128 DLOAD
FLAG -928 7056 DLOAD
FLAG 896 6704 0
FLAG 896 6032 VCC5
FLAG 896 7584 0
FLAG 896 6912 VCC5
FLAG 896 7232 _DATA
FLAG 896 6352 DATA
FLAG 896 5952 _CLK
FLAG 2144 7232 BJTQ
FLAG 2288 6352 _BJTQ
FLAG 4240 7232 BJTDOUT
FLAG 2992 7568 0
FLAG 3024 6912 VCC
FLAG 3328 7136 DLOAD
FLAG -3344 6256 VCC5
FLAG -3376 6688 0
FLAG -3168 6464 _DLOAD
FLAG -3440 6464 CLK
FLAG -1680 8624 0
FLAG -1648 8192 VCC
FLAG -1344 8304 _DLOAD
FLAG 912 8400 DynOUT
FLAG 0 8304 DLOAD
FLAG -1680 8400 DATA
FLAG -1680 9184 0
FLAG -1648 8752 VCC
FLAG -1344 8864 _DLOAD
FLAG 96 8960 DynOUT2
FLAG -560 8864 DLOAD
FLAG -1680 8960 _DATA
FLAG 224 8864 _DLOAD
FLAG 1664 8960 DynOUT3
FLAG 1008 8864 DLOAD
FLAG 1040 8624 0
FLAG 1072 8192 VCC
FLAG 1376 8304 _DLOAD
FLAG 3632 8400 DynOUTb
FLAG 2720 8304 DLOAD
FLAG 4928 6672 0
FLAG 4928 6000 VCC5
FLAG 4928 7552 0
FLAG 4928 6880 VCC5
FLAG 4928 7200 _DATA
FLAG 4928 6320 DATA
FLAG 4928 5920 _CLK
FLAG 6464 6672 0
FLAG 6464 6000 VCC5
FLAG 6464 7552 0
FLAG 6464 6880 VCC5
FLAG 6464 5920 CLK
FLAG 7712 7200 BJTQ2
FLAG 7728 6320 _BJTQ2
SYMBOL voltage -2432 5408 R0
WINDOW 123 0 0 Left 0
WINDOW 39 0 0 Left 0
SYMATTR InstName VCC
SYMATTR Value {VCC}
SYMBOL voltage -2000 5424 R0
WINDOW 123 -77 30 VRight 2
WINDOW 39 0 0 Left 0
WINDOW 0 -51 28 VRight 2
WINDOW 3 647 148 Right 2
SYMATTR Value2 AC 5
SYMATTR InstName V_BIT5
SYMATTR Value PULSE(0 {VCC} 0 {rise} {rise} {2*1/freq/1.5-rise} {2*1/freq/0.75} {256*reps})
SYMBOL Digital\\and -384 5648 R0
SYMATTR InstName A1
SYMBOL Digital\\and -384 5872 R0
SYMATTR InstName A2
SYMBOL Digital\\or -576 5664 R0
SYMATTR InstName A3
SYMBOL Digital\\or -576 5776 R0
SYMATTR InstName A4
SYMBOL Digital\\or -576 5936 R0
SYMATTR InstName A5
SYMBOL Digital\\or -576 6064 R0
SYMATTR InstName A6
SYMBOL Digital\\inv -720 6080 R270
SYMATTR InstName A7
SYMBOL voltage -1824 5424 R0
WINDOW 123 -77 30 VRight 2
WINDOW 39 0 0 Left 0
WINDOW 0 -51 28 VRight 2
WINDOW 3 521 -129 Right 2
SYMATTR Value2 AC 5
SYMATTR InstName V_BIT1
SYMATTR Value PULSE(0 {VCC} {1/freq/4} {rise} {rise} {1/freq/2-rise} {1/freq} {128*reps})
SYMBOL nmos -1648 6384 R0
SYMATTR InstName M17
SYMATTR Value 2N7002
SYMBOL nmos -1648 6560 R0
SYMATTR InstName M18
SYMATTR Value 2N7002
SYMBOL pmos -1648 6112 M180
SYMATTR InstName M19
SYMATTR Value BSS84
SYMBOL pmos -1744 5968 M180
SYMATTR InstName M20
SYMATTR Value BSS84
SYMBOL voltage -2288 5408 R0
WINDOW 123 0 0 Left 0
WINDOW 39 0 0 Left 0
SYMATTR InstName VCC1
SYMATTR Value {VCC+1.7}
SYMBOL pmos -1168 7120 M180
SYMATTR InstName M33
SYMATTR Value BSS84
SYMBOL nmos -1168 7184 R0
SYMATTR InstName M34
SYMATTR Value 2N7002
SYMBOL pmos -128 7120 M180
SYMATTR InstName M35
SYMATTR Value BSS84
SYMBOL nmos -128 7184 R0
SYMATTR InstName M36
SYMATTR Value 2N7002
SYMBOL nmos -800 7104 R90
SYMATTR InstName M37
SYMATTR Value 2N7002
SYMBOL nmos -752 7104 M90
SYMATTR InstName M38
SYMATTR Value 2N7002
SYMBOL pmos -2384 6096 M180
SYMATTR InstName M39
SYMATTR Value BSS84
SYMBOL nmos -2384 6160 R0
SYMATTR InstName M40
SYMATTR Value 2N7002
SYMBOL cap -448 7216 R0
SYMATTR InstName C2
SYMATTR Value 520p
SYMBOL pmos -2720 6656 M180
SYMATTR InstName M41
SYMATTR Value BSS84
SYMBOL nmos -2720 6720 R0
SYMATTR InstName M42
SYMATTR Value 2N7002
SYMBOL diode -2800 6800 R180
WINDOW 0 24 64 Left 2
WINDOW 3 24 0 Left 2
SYMATTR InstName D25
SYMATTR Value 1N914
SYMBOL diode -2800 6624 R180
WINDOW 0 24 64 Left 2
WINDOW 3 24 0 Left 2
SYMATTR InstName D26
SYMATTR Value 1N914
SYMBOL pmos -1744 6192 M180
SYMATTR InstName M45
SYMATTR Value BSS84
SYMBOL nmos -1792 6336 R0
SYMATTR InstName M46
SYMATTR Value 2N7002
SYMBOL nmos -1648 7472 R0
SYMATTR InstName M47
SYMATTR Value 2N7002
SYMBOL nmos -1648 7648 R0
SYMATTR InstName M48
SYMATTR Value 2N7002
SYMBOL pmos -1648 7200 M180
SYMATTR InstName M49
SYMATTR Value BSS84
SYMBOL pmos -1744 7056 M180
SYMATTR InstName M50
SYMATTR Value BSS84
SYMBOL pmos -1744 7280 M180
SYMATTR InstName M51
SYMATTR Value BSS84
SYMBOL nmos -1792 7424 R0
SYMATTR InstName M52
SYMATTR Value 2N7002
SYMBOL pmos -2720 6096 M180
SYMATTR InstName M1
SYMATTR Value BSS84
SYMBOL nmos -2720 6160 R0
SYMATTR InstName M2
SYMATTR Value 2N7002
SYMBOL diode -2800 6240 R180
WINDOW 0 24 64 Left 2
WINDOW 3 24 0 Left 2
SYMATTR InstName D1
SYMATTR Value 1N914
SYMBOL diode -2800 6064 R180
WINDOW 0 24 64 Left 2
WINDOW 3 24 0 Left 2
SYMATTR InstName D2
SYMATTR Value 1N914
SYMBOL npn 1952 6432 R0
SYMATTR InstName Q1
SYMATTR Value 2N3904
SYMBOL schottky 1920 6400 R270
WINDOW 0 32 32 VTop 2
WINDOW 3 0 32 VBottom 2
SYMATTR InstName D3
SYMATTR Value BAT54
SYMATTR Description Diode
SYMATTR Type diode
SYMBOL res 976 6048 R270
WINDOW 0 32 56 VTop 2
WINDOW 3 0 56 VBottom 2
SYMATTR InstName R1
SYMATTR Value 1m
SYMBOL npn 1648 6176 R0
SYMATTR InstName Q2
SYMATTR Value 2N3904
SYMBOL res 2000 6112 R0
SYMATTR InstName R2
SYMATTR Value {Rout_pull}
SYMBOL res 1696 6336 R0
SYMATTR InstName R3
SYMATTR Value {Rin*2}
SYMBOL res 1696 6512 R0
SYMATTR InstName R4
SYMATTR Value {Rin}
SYMBOL npn 1952 7312 R0
SYMATTR InstName Q3
SYMATTR Value 2N3904
SYMBOL schottky 1920 7280 R270
WINDOW 0 32 32 VTop 2
WINDOW 3 0 32 VBottom 2
SYMATTR InstName D4
SYMATTR Value BAT54
SYMATTR Description Diode
SYMATTR Type diode
SYMBOL npn 1648 7056 R0
SYMATTR InstName Q4
SYMATTR Value 2N3904
SYMBOL res 2000 6992 R0
SYMATTR InstName R5
SYMATTR Value {Rout_pull}
SYMBOL res 1696 7216 R0
SYMATTR InstName R6
SYMATTR Value {Rin*2}
SYMBOL res 1696 7392 R0
SYMATTR InstName R7
SYMATTR Value {Rin}
SYMBOL npn 1472 6096 R0
SYMATTR InstName Q5
SYMATTR Value 2N3904
SYMBOL pnp 1328 6400 M180
SYMATTR InstName Q6
SYMATTR Value 2N3906
SYMBOL pnp 1200 6560 M180
SYMATTR InstName Q7
SYMATTR Value 2N3906
SYMBOL res 976 6928 R270
WINDOW 0 32 56 VTop 2
WINDOW 3 0 56 VBottom 2
SYMATTR InstName R8
SYMATTR Value 1m
SYMBOL npn 1472 6976 R0
SYMATTR InstName Q8
SYMATTR Value 2N3904
SYMBOL pnp 1328 7280 M180
SYMATTR InstName Q9
SYMATTR Value 2N3906
SYMBOL pnp 1200 7440 M180
SYMATTR InstName Q10
SYMATTR Value 2N3906
SYMBOL res 1248 6912 R0
SYMATTR InstName R9
SYMATTR Value {Rc_up}
SYMBOL res 1248 6032 R0
SYMATTR InstName R10
SYMATTR Value {Rc_up}
SYMBOL pmos 3088 7200 M180
SYMATTR InstName M3
SYMATTR Value BSS84
SYMBOL nmos 3088 7264 R0
SYMATTR InstName M4
SYMATTR Value 2N7002
SYMBOL pmos 4128 7200 M180
SYMATTR InstName M5
SYMATTR Value BSS84
SYMBOL nmos 4128 7264 R0
SYMATTR InstName M6
SYMATTR Value 2N7002
SYMBOL nmos 3456 7184 R90
SYMATTR InstName M7
SYMATTR Value 2N7002
SYMBOL nmos 3504 7184 M90
SYMATTR InstName M8
SYMATTR Value 2N7002
SYMBOL cap 3808 7296 R0
SYMATTR InstName C1
SYMATTR Value 520p
SYMBOL pmos -3280 6432 M180
SYMATTR InstName M9
SYMATTR Value BSS84
SYMBOL nmos -3280 6496 R0
SYMATTR InstName M10
SYMATTR Value 2N7002
SYMBOL pmos -1584 8368 M180
SYMATTR InstName M11
SYMATTR Value BSS84
SYMBOL nmos -1584 8432 R0
SYMATTR InstName M12
SYMATTR Value 2N7002
SYMBOL pmos -544 8368 M180
SYMATTR InstName M13
SYMATTR Value BSS84
SYMBOL nmos -544 8432 R0
SYMATTR InstName M14
SYMATTR Value 2N7002
SYMBOL nmos -1216 8352 R90
SYMATTR InstName M15
SYMATTR Value 2N7002
SYMBOL nmos -1168 8352 M90
SYMATTR InstName M16
SYMATTR Value 2N7002
SYMBOL cap -864 8464 R0
SYMATTR InstName C3
SYMATTR Value 520p
SYMBOL pmos -240 8368 M180
SYMATTR InstName M21
SYMATTR Value BSS84
SYMBOL nmos -240 8432 R0
SYMATTR InstName M22
SYMATTR Value 2N7002
SYMBOL pmos 800 8368 M180
SYMATTR InstName M23
SYMATTR Value BSS84
SYMBOL nmos 800 8432 R0
SYMATTR InstName M24
SYMATTR Value 2N7002
SYMBOL nmos 128 8352 R90
SYMATTR InstName M25
SYMATTR Value 2N7002
SYMBOL nmos 176 8352 M90
SYMATTR InstName M26
SYMATTR Value 2N7002
SYMBOL cap 480 8464 R0
SYMATTR InstName C4
SYMATTR Value 520p
SYMBOL pmos -1584 8928 M180
SYMATTR InstName M27
SYMATTR Value BSS84
SYMBOL nmos -1584 8992 R0
SYMATTR InstName M28
SYMATTR Value 2N7002
SYMBOL nmos -1216 8912 R90
SYMATTR InstName M31
SYMATTR Value 2N7002
SYMBOL nmos -1168 8912 M90
SYMATTR InstName M32
SYMATTR Value 2N7002
SYMBOL cap -1008 9024 R0
SYMATTR InstName C5
SYMATTR Value 520p
SYMBOL pmos -800 8928 M180
SYMATTR InstName M43
SYMATTR Value BSS84
SYMBOL nmos -800 8992 R0
SYMATTR InstName M44
SYMATTR Value 2N7002
SYMBOL pmos -16 8928 M180
SYMATTR InstName M53
SYMATTR Value BSS84
SYMBOL nmos -16 8992 R0
SYMATTR InstName M54
SYMATTR Value 2N7002
SYMBOL nmos -432 8912 R90
SYMATTR InstName M55
SYMATTR Value 2N7002
SYMBOL nmos -384 8912 M90
SYMATTR InstName M56
SYMATTR Value 2N7002
SYMBOL cap -208 9024 R0
SYMATTR InstName C6
SYMATTR Value 520p
SYMBOL nmos 352 8912 R90
SYMATTR InstName M29
SYMATTR Value 2N7002
SYMBOL nmos 400 8912 M90
SYMATTR InstName M30
SYMATTR Value 2N7002
SYMBOL cap 560 9024 R0
SYMATTR InstName C7
SYMATTR Value 520p
SYMBOL pmos 768 8928 M180
SYMATTR InstName M57
SYMATTR Value BSS84
SYMBOL nmos 768 8992 R0
SYMATTR InstName M58
SYMATTR Value 2N7002
SYMBOL pmos 1552 8928 M180
SYMATTR InstName M59
SYMATTR Value BSS84
SYMBOL nmos 1552 8992 R0
SYMATTR InstName M60
SYMATTR Value 2N7002
SYMBOL nmos 1136 8912 R90
SYMATTR InstName M61
SYMATTR Value 2N7002
SYMBOL nmos 1184 8912 M90
SYMATTR InstName M62
SYMATTR Value 2N7002
SYMBOL cap 1360 9024 R0
SYMATTR InstName C8
SYMATTR Value 520p
SYMBOL pmos 1136 8368 M180
SYMATTR InstName M63
SYMATTR Value BSS84
SYMBOL nmos 1136 8432 R0
SYMATTR InstName M64
SYMATTR Value 2N7002
SYMBOL pmos 2176 8368 M180
SYMATTR InstName M65
SYMATTR Value BSS84
SYMBOL nmos 2176 8432 R0
SYMATTR InstName M66
SYMATTR Value 2N7002
SYMBOL nmos 1504 8352 R90
SYMATTR InstName M67
SYMATTR Value 2N7002
SYMBOL nmos 1552 8352 M90
SYMATTR InstName M68
SYMATTR Value 2N7002
SYMBOL cap 1856 8464 R0
SYMATTR InstName C9
SYMATTR Value 520p
SYMBOL pmos 2480 8368 M180
SYMATTR InstName M69
SYMATTR Value BSS84
SYMBOL nmos 2480 8432 R0
SYMATTR InstName M70
SYMATTR Value 2N7002
SYMBOL pmos 3520 8368 M180
SYMATTR InstName M71
SYMATTR Value BSS84
SYMBOL nmos 3520 8432 R0
SYMATTR InstName M72
SYMATTR Value 2N7002
SYMBOL nmos 2848 8352 R90
SYMATTR InstName M73
SYMATTR Value 2N7002
SYMBOL nmos 2896 8352 M90
SYMATTR InstName M74
SYMATTR Value 2N7002
SYMBOL cap 3200 8464 R0
SYMATTR InstName C10
SYMATTR Value 520p
SYMBOL npn 5984 6400 R0
SYMATTR InstName Q13
SYMATTR Value 2N3904
SYMBOL schottky 5952 6368 R270
WINDOW 0 32 32 VTop 2
WINDOW 3 0 32 VBottom 2
SYMATTR InstName D5
SYMATTR Value BAT54
SYMATTR Description Diode
SYMATTR Type diode
SYMBOL res 5008 6016 R270
WINDOW 0 32 56 VTop 2
WINDOW 3 0 56 VBottom 2
SYMATTR InstName R13
SYMATTR Value 1m
SYMBOL npn 5680 6144 R0
SYMATTR InstName Q14
SYMATTR Value 2N3904
SYMBOL res 6032 6080 R0
SYMATTR InstName R14
SYMATTR Value {Rout_pull}
SYMBOL res 5728 6304 R0
SYMATTR InstName R15
SYMATTR Value {Rin*2}
SYMBOL res 5728 6480 R0
SYMATTR InstName R16
SYMATTR Value {Rin}
SYMBOL npn 5984 7280 R0
SYMATTR InstName Q15
SYMATTR Value 2N3904
SYMBOL schottky 5952 7248 R270
WINDOW 0 32 32 VTop 2
WINDOW 3 0 32 VBottom 2
SYMATTR InstName D6
SYMATTR Value BAT54
SYMATTR Description Diode
SYMATTR Type diode
SYMBOL npn 5680 7024 R0
SYMATTR InstName Q16
SYMATTR Value 2N3904
SYMBOL res 6032 6960 R0
SYMATTR InstName R17
SYMATTR Value {Rout_pull}
SYMBOL res 5728 7184 R0
SYMATTR InstName R18
SYMATTR Value {Rin*2}
SYMBOL res 5728 7360 R0
SYMATTR InstName R19
SYMATTR Value {Rin}
SYMBOL npn 5504 6064 R0
SYMATTR InstName Q17
SYMATTR Value 2N3904
SYMBOL pnp 5360 6368 M180
SYMATTR InstName Q18
SYMATTR Value 2N3906
SYMBOL pnp 5232 6528 M180
SYMATTR InstName Q19
SYMATTR Value 2N3906
SYMBOL res 5008 6896 R270
WINDOW 0 32 56 VTop 2
WINDOW 3 0 56 VBottom 2
SYMATTR InstName R20
SYMATTR Value 1m
SYMBOL npn 5504 6944 R0
SYMATTR InstName Q20
SYMATTR Value 2N3904
SYMBOL pnp 5360 7248 M180
SYMATTR InstName Q21
SYMATTR Value 2N3906
SYMBOL pnp 5232 7408 M180
SYMATTR InstName Q22
SYMATTR Value 2N3906
SYMBOL res 5280 6880 R0
SYMATTR InstName R21
SYMATTR Value {Rc_up}
SYMBOL res 5280 6000 R0
SYMATTR InstName R22
SYMATTR Value {Rc_up}
SYMBOL npn 7520 6400 R0
SYMATTR InstName Q23
SYMATTR Value 2N3904
SYMBOL schottky 7488 6368 R270
WINDOW 0 32 32 VTop 2
WINDOW 3 0 32 VBottom 2
SYMATTR InstName D7
SYMATTR Value BAT54
SYMATTR Description Diode
SYMATTR Type diode
SYMBOL res 6544 6016 R270
WINDOW 0 32 56 VTop 2
WINDOW 3 0 56 VBottom 2
SYMATTR InstName R23
SYMATTR Value 1m
SYMBOL npn 7216 6144 R0
SYMATTR InstName Q24
SYMATTR Value 2N3904
SYMBOL res 7568 6080 R0
SYMATTR InstName R24
SYMATTR Value {Rout_pull}
SYMBOL res 7264 6304 R0
SYMATTR InstName R25
SYMATTR Value {Rin*2}
SYMBOL res 7264 6480 R0
SYMATTR InstName R26
SYMATTR Value {Rin}
SYMBOL npn 7520 7280 R0
SYMATTR InstName Q25
SYMATTR Value 2N3904
SYMBOL schottky 7488 7248 R270
WINDOW 0 32 32 VTop 2
WINDOW 3 0 32 VBottom 2
SYMATTR InstName D8
SYMATTR Value BAT54
SYMATTR Description Diode
SYMATTR Type diode
SYMBOL npn 7216 7024 R0
SYMATTR InstName Q26
SYMATTR Value 2N3904
SYMBOL res 7568 6960 R0
SYMATTR InstName R27
SYMATTR Value {Rout_pull}
SYMBOL res 7264 7184 R0
SYMATTR InstName R28
SYMATTR Value {Rin*2}
SYMBOL res 7264 7360 R0
SYMATTR InstName R29
SYMATTR Value {Rin}
SYMBOL npn 7040 6064 R0
SYMATTR InstName Q27
SYMATTR Value 2N3904
SYMBOL pnp 6896 6368 M180
SYMATTR InstName Q28
SYMATTR Value 2N3906
SYMBOL pnp 6768 6528 M180
SYMATTR InstName Q29
SYMATTR Value 2N3906
SYMBOL res 6544 6896 R270
WINDOW 0 32 56 VTop 2
WINDOW 3 0 56 VBottom 2
SYMATTR InstName R30
SYMATTR Value 1m
SYMBOL npn 7040 6944 R0
SYMATTR InstName Q30
SYMATTR Value 2N3904
SYMBOL pnp 6896 7248 M180
SYMATTR InstName Q31
SYMATTR Value 2N3906
SYMBOL pnp 6768 7408 M180
SYMATTR InstName Q32
SYMATTR Value 2N3906
SYMBOL res 6816 6880 R0
SYMATTR InstName R31
SYMATTR Value {Rc_up}
SYMBOL res 6816 6000 R0
SYMATTR InstName R32
SYMATTR Value {Rc_up}
TEXT -2744 5640 Left 2 !.tran {32*reps/freq}
TEXT -2744 5368 Left 2 !.param VCC=3.3
TEXT -2744 5400 Left 2 !.param freq=11mega
TEXT -2744 5432 Left 2 !.param rise=1n
TEXT -2744 5464 Left 2 !.param reps=1
TEXT -928 6128 Left 2 ;PAR_LD
TEXT -912 6104 Left 2 ;PAR_D
TEXT -904 6000 Left 2 ;SHIFT
TEXT -2744 5528 Left 2 !.param Rin=100
TEXT -2744 5560 Left 2 !.param Rout_pull=300
TEXT -2744 5592 Left 2 !.param Rin_ld = 1000
TEXT -2744 5496 Left 2 !.param Rc_up=300
TEXT -2744 5680 Left 2 !.step temp -25 125 25
TEXT -2744 5712 Left 2 !.temp 125

The netlist it stands for:
* d_flop_cmos.asc
VCC VCC 0 {VCC}
V_BIT5 DATA 0 PULSE(0 {VCC} 0 {rise} {rise} {2*1/freq/1.5-rise} {2*1/freq/0.75} {256*reps}) AC 5
A1 0 N001 N002 N005 0 N006 0 0 AND
A2 0 N006 N010 N011 0 N005 0 0 AND
A3 0 0 N004 N007 0 0 N001 0 OR
A4 0 N008 N009 0 0 0 N002 0 OR
A5 0 N003 N007 0 0 0 N010 0 OR
A6 0 N016 N009 0 0 0 N011 0 OR
A7 N016 0 0 0 0 N008 0 0 BUF
V_BIT1 CLK 0 PULSE(0 {VCC} {1/freq/4} {rise} {rise} {1/freq/2-rise} {1/freq} {128*reps}) AC 5
M17 _Q DATA N028 N028 2N7002
M18 N028 Q 0 0 2N7002
M19 _Q Q VCC VCC BSS84
M20 N015 DATA VCC VCC BSS84
VCC1 VCC5 0 {VCC+1.7}
M33 N037 Q VCC VCC BSS84
M34 N037 Q 0 0 2N7002
M35 DOUT N035 VCC VCC BSS84
M36 DOUT N035 0 0 2N7002
M37 N038 DLOAD N037 N037 2N7002
M38 N038 DLOAD N035 N035 2N7002
M39 DLOAD _CLK VCC5 VCC5 BSS84
M40 DLOAD _CLK 0 0 2N7002
C2 NC_01 0 520p
M41 _DATA DATA VCC VCC BSS84
M42 _DATA DATA 0 0 2N7002
D25 0 DATA 1N914
D26 DATA VCC 1N914
M45 _Q CLK N015 N015 BSS84
M46 _Q CLK N028 N028 2N7002
M47 Q _DATA N048 N048 2N7002
M48 N048 _Q 0 0 2N7002
M49 Q _Q VCC VCC BSS84
M50 N041 _DATA VCC VCC BSS84
M51 Q CLK N041 N041 BSS84
M52 Q CLK N048 N048 2N7002
M1 _CLK CLK VCC VCC BSS84
M2 _CLK CLK 0 0 2N7002
D1 0 CLK 1N914
D2 CLK VCC 1N914
Q1 _BJTQ N027 0 0 2N3904
D3 N027 _BJTQ BAT54
R1 VCC5 N014 1m
Q2 N014 BJTQ N024 0 2N3904
R2 N014 _BJTQ {Rout_pull}
R3 N024 N027 {Rin*2}
R4 N027 0 {Rin}
Q3 BJTQ N047 0 0 2N3904
D4 N047 BJTQ BAT54
Q4 N031 _BJTQ N042 0 2N3904
R5 N031 BJTQ {Rout_pull}
R6 N042 N047 {Rin*2}
R7 N047 0 {Rin}
Q5 N014 N019 N024 0 2N3904
Q6 0 DATA N019 0 2N3906
Q7 0 _CLK N019 0 2N3906
R8 VCC5 N031 1m
Q8 N031 N034 N042 0 2N3904
Q9 0 _DATA N034 0 2N3906
Q10 0 _CLK N034 0 2N3906
R9 N031 N034 {Rc_up}
R10 N014 N019 {Rc_up}
M3 N043 BJTQ VCC VCC BSS84
M4 N043 BJTQ 0 0 2N7002
M5 BJTDOUT N036 VCC VCC BSS84
M6 BJTDOUT N036 0 0 2N7002
M7 N044 DLOAD N043 N043 2N7002
M8 N044 DLOAD N036 N036 2N7002
C1 NC_02 0 520p
M9 _DLOAD CLK VCC5 VCC5 BSS84
M10 _DLOAD CLK 0 0 2N7002
M11 N055 DATA VCC VCC BSS84
M12 N055 DATA 0 0 2N7002
M13 N050 N049 VCC VCC BSS84
M14 N050 N049 0 0 2N7002
M15 N056 _DLOAD N055 N055 2N7002
M16 N056 _DLOAD N049 N049 2N7002
C3 NC_03 0 520p
M21 N057 N050 VCC VCC BSS84
M22 N057 N050 0 0 2N7002
M23 DynOUT N051 VCC VCC BSS84
M24 DynOUT N051 0 0 2N7002
M25 N058 DLOAD N057 N057 2N7002
M26 N058 DLOAD N051 N051 2N7002
C4 NC_04 0 520p
M27 N067 _DATA VCC VCC BSS84
M28 N067 _DATA 0 0 2N7002
M31 N068 _DLOAD N067 N067 2N7002
M32 N068 _DLOAD N063 N063 2N7002
C5 NC_05 0 520p
M43 N069 N063 VCC VCC BSS84
M44 N069 N063 0 0 2N7002
M53 DynOUT2 N064 VCC VCC BSS84
M54 DynOUT2 N064 0 0 2N7002
M55 N070 DLOAD N069 N069 2N7002
M56 N070 DLOAD N064 N064 2N7002
C6 NC_06 0 520p
M29 N071 _DLOAD DynOUT2 DynOUT2 2N7002
M30 N071 _DLOAD N065 N065 2N7002
C7 NC_07 0 520p
M57 N072 N065 VCC VCC BSS84
M58 N072 N065 0 0 2N7002
M59 DynOUT3 N066 VCC VCC BSS84
M60 DynOUT3 N066 0 0 2N7002
M61 N073 DLOAD N072 N072 2N7002
M62 N073 DLOAD N066 N066 2N7002
C8 NC_08 0 520p
M63 N059 DynOUT VCC VCC BSS84
M64 N059 DynOUT 0 0 2N7002
M65 N053 N052 VCC VCC BSS84
M66 N053 N052 0 0 2N7002
M67 N060 _DLOAD N059 N059 2N7002
M68 N060 _DLOAD N052 N052 2N7002
C9 NC_09 0 520p
M69 N061 N053 VCC VCC BSS84
M70 N061 N053 0 0 2N7002
M71 DynOUTb N054 VCC VCC BSS84
M72 DynOUTb N054 0 0 2N7002
M73 N062 DLOAD N061 N061 2N7002
M74 N062 DLOAD N054 N054 2N7002
C10 NC_10 0 520p
Q13 N021 N025 0 0 2N3904
D5 N025 N021 BAT54
R13 VCC5 N012 1m
Q14 N012 N020 N022 0 2N3904
R14 N012 N021 {Rout_pull}
R15 N022 N025 {Rin*2}
R16 N025 0 {Rin}
Q15 N020 N045 0 0 2N3904
D6 N045 N020 BAT54
Q16 N029 N021 N039 0 2N3904
R17 N029 N020 {Rout_pull}
R18 N039 N045 {Rin*2}
R19 N045 0 {Rin}
Q17 N012 N017 N022 0 2N3904
Q18 0 DATA N017 0 2N3906
Q19 0 _CLK N017 0 2N3906
R20 VCC5 N029 1m
Q20 N029 N032 N039 0 2N3904
Q21 0 _DATA N032 0 2N3906
Q22 0 _CLK N032 0 2N3906
R21 N029 N032 {Rc_up}
R22 N012 N017 {Rc_up}
Q23 _BJTQ2 N026 0 0 2N3904
D7 N026 _BJTQ2 BAT54
R23 VCC5 N013 1m
Q24 N013 BJTQ2 N023 0 2N3904
R24 N013 _BJTQ2 {Rout_pull}
R25 N023 N026 {Rin*2}
R26 N026 0 {Rin}
Q25 BJTQ2 N046 0 0 2N3904
D8 N046 BJTQ2 BAT54
Q26 N030 _BJTQ2 N040 0 2N3904
R27 N030 BJTQ2 {Rout_pull}
R28 N040 N046 {Rin*2}
R29 N046 0 {Rin}
Q27 N013 N018 N023 0 2N3904
Q28 0 N020 N018 0 2N3906
Q29 0 CLK N018 0 2N3906
R30 VCC5 N030 1m
Q30 N030 N033 N040 0 2N3904
Q31 0 N021 N033 0 2N3906
Q32 0 CLK N033 0 2N3906
R31 N030 N033 {Rc_up}
R32 N013 N018 {Rc_up}
.model D D
.lib standard.dio
.model NPN NPN
.model PNP PNP
.lib standard.bjt
.model NMOS NMOS
.model PMOS PMOS
.lib standard.mos
.tran {32*reps/freq}
.param VCC=3.3
.param freq=11mega
.param rise=1n
.param reps=1
* PAR_LD
* PAR_D
* SHIFT
.param Rin=100
.param Rout_pull=300
.param Rin_ld = 1000
.param Rc_up=300
.step temp -25 125 25
.temp 125
.backanno
.end